# EAGLE schematic 8MIC_ximpedance_J007901D (EAGLE 7.7.0)
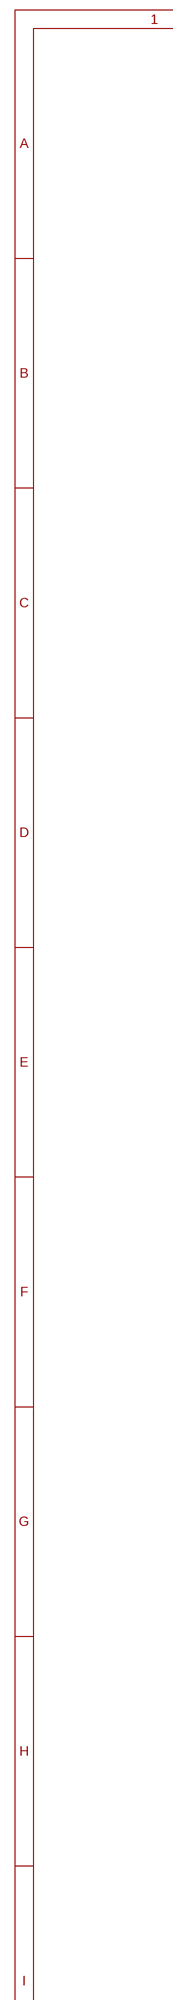
[diagram p0: schematic, sheet 1, part 1 of 2]
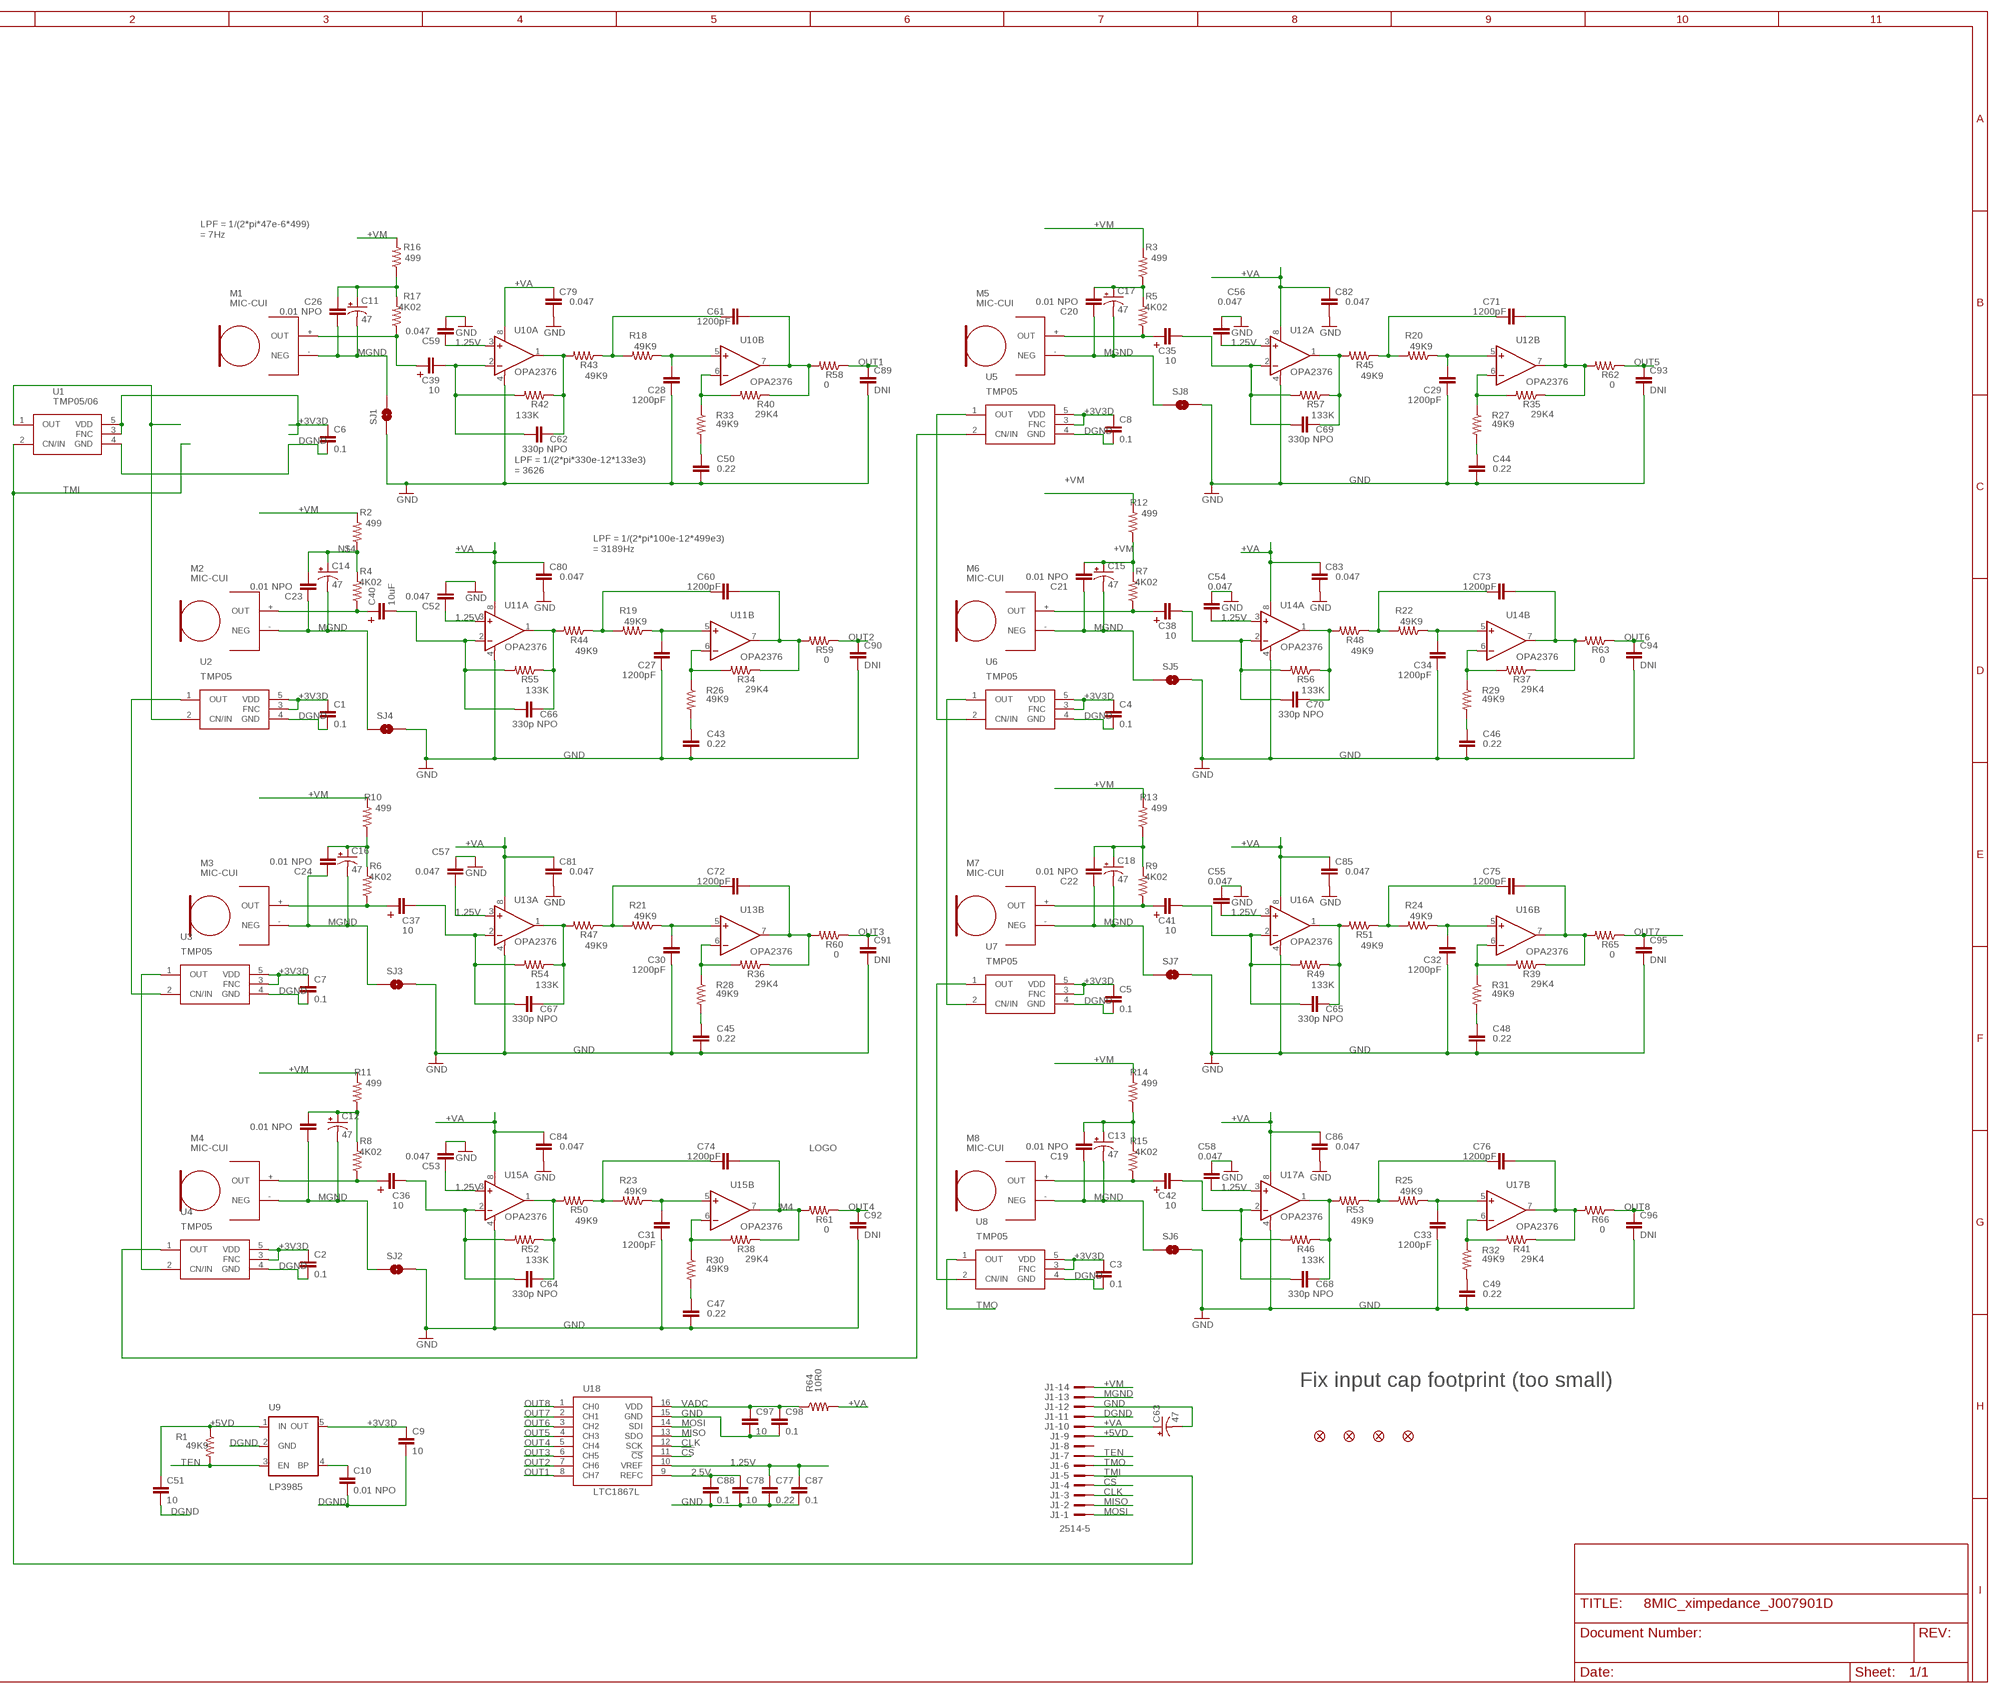
[diagram p1: schematic, sheet 1, part 2 of 2]

## Parts
C1  0.1  CAPS0805S  [0805S]
C2  0.1  CAPS0805S  [0805S]
C3  0.1  CAPS0805S  [0805S]
C4  0.1  CAPS0805S  [0805S]
C5  0.1  CAPS0805S  [0805S]
C6  0.1  CAPS0805S  [0805S]
C7  0.1  CAPS0805S  [0805S]
C8  0.1  CAPS0805S  [0805S]
C9  10  CAPS0805S  [0805S]
C10  0.01 NPO  CAPS0603S  [0603S]
C11  47  CAP_POL1206  [EIA3216]
C12  47  CAP_POL1206  [EIA3216]
C13  47  CAP_POL1206  [EIA3216]
C14  47  CAP_POL1206  [EIA3216]
C15  47  CAP_POL1206  [EIA3216]
C16  47  CAP_POL1206  [EIA3216]
C17  47  CAP_POL1206  [EIA3216]
C18  47  CAP_POL1206  [EIA3216]
C19  0.01 NPO  CAPS0603S  [0603S]
C20  0.01 NPO  CAPS0603S  [0603S]
C21  0.01 NPO  CAPS0603S  [0603S]
C22  0.01 NPO  CAPS0603S  [0603S]
C23  0.01 NPO  CAPS0603S  [0603S]
C24  0.01 NPO  CAPS0603S  [0603S]
C25  0.01 NPO  CAPS0603S  [0603S]
C26  0.01 NPO  CAPS0603S  [0603S]
C27  1200pF  CAPS1206S  [1206S]
C28  1200pF  CAPS1206S  [1206S]
C29  1200pF  CAPS1206S  [1206S]
C30  1200pF  CAPS1206S  [1206S]
C31  1200pF  CAPS1206S  [1206S]
C32  1200pF  CAPS1206S  [1206S]
C33  1200pF  CAPS1206S  [1206S]
C34  1200pF  CAPS1206S  [1206S]
C35  10  CAPS_POLCAP_E_A  [CAP_ELEC_A]
C36  10  CAPS_POLCAP_E_A  [CAP_ELEC_A]
C37  10  CAPS_POLCAP_E_A  [CAP_ELEC_A]
C38  10  CAPS_POLCAP_E_A  [CAP_ELEC_A]
C39  10  CAPS_POLCAP_E_A  [CAP_ELEC_A]
C40  10uF  CAPS_POLCAP_E_A  [CAP_ELEC_A]
C41  10  CAPS_POLCAP_E_A  [CAP_ELEC_A]
C42  10  CAPS_POLCAP_E_A  [CAP_ELEC_A]
C43  0.22  CAPS1206S  [1206S]
C44  0.22  CAPS1206S  [1206S]
C45  0.22  CAPS1206S  [1206S]
C46  0.22  CAPS1206S  [1206S]
C47  0.22  CAPS1206S  [1206S]
C48  0.22  CAPS1206S  [1206S]
C49  0.22  CAPS1206S  [1206S]
C50  0.22  CAPS1206S  [1206S]
C51  10  CAPS0805S  [0805S]
C52  0.047  CAPS0805S  [0805S]
C53  0.047  CAPS0805S  [0805S]
C54  0.047  CAPS0805S  [0805S]
C55  0.047  CAPS0805S  [0805S]
C56  0.047  CAPS0805S  [0805S]
C57  0.047  CAPS0805S  [0805S]
C58  0.047  CAPS0805S  [0805S]
C59  0.047  CAPS0805S  [0805S]
C60  1200pF  CAPS1206S  [1206S]
C61  1200pF  CAPS1206S  [1206S]
C62  330p NPO  CAPS0805S  [0805S]
C63  47  CAP_POL1206  [EIA3216]
C64  330p NPO  CAPS0805S  [0805S]
C65  330p NPO  CAPS0805S  [0805S]
C66  330p NPO  CAPS0805S  [0805S]
C67  330p NPO  CAPS0805S  [0805S]
C68  330p NPO  CAPS0805S  [0805S]
C69  330p NPO  CAPS0805S  [0805S]
C70  330p NPO  CAPS0805S  [0805S]
C71  1200pF  CAPS1206S  [1206S]
C72  1200pF  CAPS1206S  [1206S]
C73  1200pF  CAPS1206S  [1206S]
C74  1200pF  CAPS1206S  [1206S]
C75  1200pF  CAPS1206S  [1206S]
C76  1200pF  CAPS1206S  [1206S]
C77  0.22  CC1206  [C1206]
C78  10  CAPS0805S  [0805S]
C79  0.047  CAPS0805S  [0805S]
C80  0.047  CAPS0805S  [0805S]
C81  0.047  CAPS0805S  [0805S]
C82  0.047  CAPS0805S  [0805S]
C83  0.047  CAPS0805S  [0805S]
C84  0.047  CAPS0805S  [0805S]
C85  0.047  CAPS0805S  [0805S]
C86  0.047  CAPS0805S  [0805S]
C87  0.1  CAPS0805S  [0805S]
C88  0.1  CAPS0805S  [0805S]
C89  DNI  CAPS0603S  [0603S]
C90  DNI  CAPS0603S  [0603S]
C91  DNI  CAPS0603S  [0603S]
C92  DNI  CAPS0603S  [0603S]
C93  DNI  CAPS0603S  [0603S]
C94  DNI  CAPS0603S  [0603S]
C95  DNI  CAPS0603S  [0603S]
C96  DNI  CAPS0603S  [0603S]
C97  10  CAPS0805S  [0805S]
C98  0.1  CAPS0805S  [0805S]
J1  2514-5  [PAK100/2500-5-14]
JP1  FIDUCIAL1.5X3  [FIDUCIAL-1.5X3]
JP2  FIDUCIAL1.5X3  [FIDUCIAL-1.5X3]
JP3  FIDUCIAL1.5X3  [FIDUCIAL-1.5X3]
JP4  FIDUCIAL1.5X3  [FIDUCIAL-1.5X3]
M1  MIC-CUI  [CUI_EDGE]
M2  MIC-CUI  [CUI_EDGE]
M3  MIC-CUI  [CUI_EDGE]
M4  MIC-CUI  [CUI_EDGE]
M5  MIC-CUI  [CUI_EDGE]
M6  MIC-CUI  [CUI_EDGE]
M7  MIC-CUI  [CUI_EDGE]
M8  MIC-CUI  [CUI_EDGE]
R1  49K9  RESISTOR_SM0603S  [0603S]
R2  499  RESISTOR_SM0603S  [0603S]
R3  499  RESISTOR_SM0603S  [0603S]
R4  4K02  RESISTOR_SM0603S  [0603S]
R5  4K02  RESISTOR_SM0603S  [0603S]
R6  4K02  RESISTOR_SM0603S  [0603S]
R7  4K02  RESISTOR_SM0603S  [0603S]
R8  4K02  RESISTOR_SM0603S  [0603S]
R9  4K02  RESISTOR_SM0603S  [0603S]
R10  499  RESISTOR_SM0603S  [0603S]
R11  499  RESISTOR_SM0603S  [0603S]
R12  499  RESISTOR_SM0603S  [0603S]
R13  499  RESISTOR_SM0603S  [0603S]
R14  499  RESISTOR_SM0603S  [0603S]
R15  4K02  RESISTOR_SM0603S  [0603S]
R16  499  RESISTOR_SM0603S  [0603S]
R17  4K02  RESISTOR_SM0603S  [0603S]
R18  49K9  RESISTOR_SM0603S  [0603S]
R19  49K9  RESISTOR_SM0603S  [0603S]
R20  49K9  RESISTOR_SM0603S  [0603S]
R21  49K9  RESISTOR_SM0603S  [0603S]
R22  49K9  RESISTOR_SM0603S  [0603S]
R23  49K9  RESISTOR_SM0603S  [0603S]
R24  49K9  RESISTOR_SM0603S  [0603S]
R25  49K9  RESISTOR_SM0603S  [0603S]
R26  49K9  RESISTOR_SM0603S  [0603S]
R27  49K9  RESISTOR_SM0603S  [0603S]
R28  49K9  RESISTOR_SM0603S  [0603S]
R29  49K9  RESISTOR_SM0603S  [0603S]
R30  49K9  RESISTOR_SM0603S  [0603S]
R31  49K9  RESISTOR_SM0603S  [0603S]
R32  49K9  RESISTOR_SM0603S  [0603S]
R33  49K9  RESISTOR_SM0603S  [0603S]
R34  29K4  RESISTOR_SM0603S  [0603S]
R35  29K4  RESISTOR_SM0603S  [0603S]
R36  29K4  RESISTOR_SM0603S  [0603S]
R37  29K4  RESISTOR_SM0603S  [0603S]
R38  29K4  RESISTOR_SM0603S  [0603S]
R39  29K4  RESISTOR_SM0603S  [0603S]
R40  29K4  RESISTOR_SM0603S  [0603S]
R41  29K4  RESISTOR_SM0603S  [0603S]
R42  133K  RESISTOR_SM0603S  [0603S]
R43  49K9  RESISTOR_SM0603S  [0603S]
R44  49K9  RESISTOR_SM0603S  [0603S]
R45  49K9  RESISTOR_SM0603S  [0603S]
R46  133K  RESISTOR_SM0603S  [0603S]
R47  49K9  RESISTOR_SM0603S  [0603S]
R48  49K9  RESISTOR_SM0603S  [0603S]
R49  133K  RESISTOR_SM0603S  [0603S]
R50  49K9  RESISTOR_SM0603S  [0603S]
R51  49K9  RESISTOR_SM0603S  [0603S]
R52  133K  RESISTOR_SM0603S  [0603S]
R53  49K9  RESISTOR_SM0603S  [0603S]
R54  133K  RESISTOR_SM0603S  [0603S]
R55  133K  RESISTOR_SM0603S  [0603S]
R56  133K  RESISTOR_SM0603S  [0603S]
R57  133K  RESISTOR_SM0603S  [0603S]
R58  0  RESISTOR_SM0603S  [0603S]
R59  0  RESISTOR_SM0603S  [0603S]
R60  0  RESISTOR_SM0603S  [0603S]
R61  0  RESISTOR_SM0603S  [0603S]
R62  0  RESISTOR_SM0603S  [0603S]
R63  0  RESISTOR_SM0603S  [0603S]
R64  10R0  RESISTOR_SM0603S  [0603S]
R65  0  RESISTOR_SM0603S  [0603S]
R66  0  RESISTOR_SM0603S  [0603S]
SJ1  SOLDERJUMPERTRACE  [SJ_2S-TRACE]
SJ2  SOLDERJUMPERTRACE  [SJ_2S-TRACE]
SJ3  SOLDERJUMPERTRACE  [SJ_2S-TRACE]
SJ4  SOLDERJUMPERTRACE  [SJ_2S-TRACE]
SJ5  SOLDERJUMPERTRACE  [SJ_2S-TRACE]
SJ6  SOLDERJUMPERTRACE  [SJ_2S-TRACE]
SJ7  SOLDERJUMPERTRACE  [SJ_2S-TRACE]
SJ8  SOLDERJUMPERTRACE  [SJ_2S-TRACE]
U1  TMP05/06  [SOT-SC-5]
U2  TMP05  TMP05/06  [SOT23-5]
U3  TMP05  TMP05/06  [SOT23-5]
U4  TMP05  TMP05/06  [SOT23-5]
U5  TMP05  TMP05/06  [SOT23-5]
U6  TMP05  TMP05/06  [SOT23-5]
U7  TMP05  TMP05/06  [SOT23-5]
U8  TMP05  TMP05/06  [SOT23-5]
U9  LP3985  MIC5203SMD  [SOT23-5]
U10  OPA2376  OPA2237E  [MSOP08]
U11  OPA2376  OPA2237E  [MSOP08]
U12  OPA2376  OPA2237E  [MSOP08]
U13  OPA2376  OPA2237E  [MSOP08]
U14  OPA2376  OPA2237E  [MSOP08]
U15  OPA2376  OPA2237E  [MSOP08]
U16  OPA2376  OPA2237E  [MSOP08]
U17  OPA2376  OPA2237E  [MSOP08]
U18  LTC1867L  LTC1867  [SSOP16]
U$1  JFRC-LOGOLOGO_OP  [LOGO_BMP_OP]

## Nets
1.25V: C52.2 C53.2 C54.2 C55.2 C56.2 C57.2 C58.2 C59.2 C77.1 C87.1 U10.3(A:+IN) U11.3(A:+IN) U12.3(A:+IN) U13.3(A:+IN) U14.3(A:+IN) U15.3(A:+IN) U16.3(A:+IN) U17.3(A:+IN) U18.10(VREF)
2.5V: C78.1 C88.1 U18.9(REFC)
!CS: J1.4 U18.11(!CS)
+3V3D: C1.1 C2.1 C3.1 C4.1 C5.1 C6.1 C7.1 C8.1 C9.1 U1.3(FNC) U1.5(VDD) U2.3(FNC) U2.5(VDD) U3.3(FNC) U3.5(VDD) U4.3(FNC) U4.5(VDD) U5.3(FNC) U5.5(VDD) U6.3(FNC) U6.5(VDD) U7.3(FNC) U7.5(VDD) U8.3(FNC) U8.5(VDD) U9.5(OUT)
+5VD: C51.1 J1.9 R1.1 U9.1(IN)
+VA: C63.A(+) C79.2 C80.2 C81.2 C82.2 C83.2 C84.2 C85.2 C86.2 J1.10 R64.2 U10.8(A:V+) U11.8(A:V+) U12.8(A:V+) U13.8(A:V+) U14.8(A:V+) U15.8(A:V+) U16.8(A:V+) U17.8(A:V+)
+VM: J1.14 R2.2 R3.2 R10.2 R11.2 R12.2 R13.2 R14.2 R16.2
CLK: J1.3 U18.12(SCK)
DGND: C1.2 C2.2 C3.2 C4.2 C5.2 C6.2 C7.2 C8.2 C9.2 C10.2 C51.2 J1.11 U1.4(GND) U2.4(GND) U3.4(GND) U4.4(GND) U5.4(GND) U6.4(GND) U7.4(GND) U8.4(GND) U9.2(GND)
GND: C27.1 C28.1 C29.1 C30.1 C31.1 C32.1 C33.1 C34.1 C43.1 C44.1 C45.1 C46.1 C47.1 C48.1 C49.1 C50.1 C52.1 C53.1 C54.1 C55.1 C56.1 C57.1 C58.1 C59.1 C63.C(-) C77.2 C78.2 C79.1 C80.1 C81.1 C82.1 C83.1 C84.1 C85.1 C86.1 C87.2 C88.2 C89.2 C90.2 C91.2 C92.2 C93.2 C94.2 C95.2 C96.2 C97.2 C98.2 J1.12 SJ1.1 SJ2.2 SJ3.2 SJ4.2 SJ5.2 SJ6.2 SJ7.2 SJ8.2 U10.4(A:V-) U11.4(A:V-) U12.4(A:V-) U13.4(A:V-) U14.4(A:V-) U15.4(A:V-) U16.4(A:V-) U17.4(A:V-) U18.15(GND)
M1: C61.1 R40.1 R58.2 U10.7(B:OUT)
M2: C60.1 R34.1 R59.2 U11.7(B:OUT)
M3: C72.1 R36.1 R60.2 U13.7(B:OUT)
M4: C74.1 R38.1 R61.2 U15.7(B:OUT)
M5: C71.1 R35.1 R62.2 U12.7(B:OUT)
M6: C73.1 R37.1 R63.2 U14.7(B:OUT)
M7: C75.1 R39.1 R65.2 U16.7(B:OUT)
M8: C76.1 R41.1 R66.2 U17.7(B:OUT)
MGND: C11.C(-) C12.C(-) C13.C(-) C14.C(-) C15.C(-) C16.C(-) C17.C(-) C18.C(-) C19.2 C20.2 C21.2 C22.2 C23.2 C24.2 C25.2 C26.2 J1.13 M1.-(NEG) M2.-(NEG) M3.-(NEG) M4.-(NEG) M5.-(NEG) M6.-(NEG) M7.-(NEG) M8.-(NEG) SJ1.2 SJ2.1 SJ3.1 SJ4.1 SJ5.1 SJ6.1 SJ7.1 SJ8.1
MIC4: C36.P(1P) M4.+(OUT) R8.1
MISO: J1.2 U18.13(SDO)
MOSI: J1.1 U18.14(SDI)
N$1: C39.P(1P) M1.+(OUT) R17.1
N$2: C39.M(2M) C62.2 R42.2 U10.2(A:-IN)
N$3: C40.P(1P) M2.+(OUT) R4.1
N$4: C14.A(+) C23.1 R2.1 R4.2
N$5: C40.M(2M) C66.2 R55.2 U11.2(A:-IN)
N$6: C62.1 R42.1 R43.2 U10.1(A:OUT)
N$7: C11.A(+) C26.1 R16.1 R17.2
N$8: C16.A(+) C24.1 R6.2 R10.1
N$9: C61.2 R18.2 R43.1
N$10: C28.2 R18.1 U10.5(B:+IN)
N$11: C17.A(+) C20.1 R3.1 R5.2
N$12: C50.2 R33.2
N$13: R33.1 R40.2 U10.6(B:-IN)
N$14: C66.1 R44.2 R55.1 U11.1(A:OUT)
N$15: C60.2 R19.2 R44.1
N$16: C27.2 R19.1 U11.5(B:+IN)
N$17: C43.2 R26.2
N$18: R26.1 R34.2 U11.6(B:-IN)
N$19: C37.P(1P) M3.+(OUT) R6.1
N$20: C12.A(+) C25.1 R8.2 R11.1
N$21: C37.M(2M) C67.2 R54.2 U13.2(A:-IN)
N$23: C67.1 R47.2 R54.1 U13.1(A:OUT)
N$24: C72.2 R21.2 R47.1
N$25: C30.2 R21.1 U13.5(B:+IN)
N$26: C45.2 R28.2
N$27: R28.1 R36.2 U13.6(B:-IN)
N$28: C15.A(+) C21.1 R7.2 R12.1
N$29: C18.A(+) C22.1 R9.2 R13.1
N$30: C36.M(2M) C64.2 R52.2 U15.2(A:-IN)
N$31: C13.A(+) C19.1 R14.1 R15.2
N$32: C64.1 R50.2 R52.1 U15.1(A:OUT)
N$33: C74.2 R23.2 R50.1
N$34: C31.2 R23.1 U15.5(B:+IN)
N$35: C47.2 R30.2
N$36: R30.1 R38.2 U15.6(B:-IN)
N$39: C35.M(2M) C69.2 R57.2 U12.2(A:-IN)
N$41: C69.1 R45.2 R57.1 U12.1(A:OUT)
N$42: C71.2 R20.2 R45.1
N$43: C29.2 R20.1 U12.5(B:+IN)
N$44: C44.2 R27.2
N$45: R27.1 R35.2 U12.6(B:-IN)
N$46: C38.P(1P) M6.+(OUT) R7.1
N$48: C38.M(2M) C70.2 R56.2 U14.2(A:-IN)
N$50: C70.1 R48.2 R56.1 U14.1(A:OUT)
N$51: C73.2 R22.2 R48.1
N$52: C34.2 R22.1 U14.5(B:+IN)
N$53: C46.2 R29.2
N$54: R29.1 R37.2 U14.6(B:-IN)
N$55: C41.P(1P) M7.+(OUT) R9.1
N$57: C41.M(2M) C65.2 R49.2 U16.2(A:-IN)
N$59: C65.1 R49.1 R51.2 U16.1(A:OUT)
N$60: C75.2 R24.2 R51.1
N$61: C32.2 R24.1 U16.5(B:+IN)
N$62: C48.2 R31.2
N$63: R31.1 R39.2 U16.6(B:-IN)
N$64: C42.P(1P) M8.+(OUT) R15.1
N$66: C42.M(2M) C68.2 R46.2 U17.2(A:-IN)
N$68: C68.1 R46.1 R53.2 U17.1(A:OUT)
N$69: C76.2 R25.2 R53.1
N$70: C33.2 R25.1 U17.5(B:+IN)
N$71: C49.2 R32.2
N$72: R32.1 R41.2 U17.6(B:-IN)
N$75: U1.1(OUT) U2.2(CN/IN)
N$76: U2.1(OUT) U3.2(CN/IN)
N$77: U3.1(OUT) U4.2(CN/IN)
N$78: U4.1(OUT) U5.2(CN/IN)
N$79: U5.1(OUT) U6.2(CN/IN)
N$80: U6.1(OUT) U7.2(CN/IN)
N$81: U7.1(OUT) U8.2(CN/IN)
N$84: C10.1 U9.4(BP)
N$90: C35.P(1P) M5.+(OUT) R5.1
OUT1: C89.1 R58.1 U18.8(CH7)
OUT2: C90.1 R59.1 U18.7(CH6)
OUT3: C91.1 R60.1 U18.6(CH5)
OUT4: C92.1 R61.1 U18.5(CH4)
OUT5: C93.1 R62.1 U18.4(CH3)
OUT6: C94.1 R63.1 U18.3(CH2)
OUT7: C95.1 R65.1 U18.2(CH1)
OUT8: C96.1 R66.1 U18.1(CH0)
TEN: J1.7 R1.2 U9.3(EN)
TMI: J1.5 U1.2(CN/IN)
TMO: J1.6 U8.1(OUT)
VADC: C97.1 C98.1 R64.1 U18.16(VDD)
Unconnected: J1.8

## Notes on the sheet
- LPF = 1/(2*pi*47e-6*499) 
  = 7Hz
- LPF = 1/(2*pi*330e-12*133e3)
  = 3626
- LPF = 1/(2*pi*100e-12*499e3)
  = 3189Hz
- Fix input cap footprint (too small)

## Library data of the parts
C1-C10 C19-C34 C43-C62 C64-C76 C78-C98 = STEVES_BU:CAPS
C11-C18 C63 = SparkFun:CAP_POL: Capacitor Polarized These are standard SMD and PTH capacitors. Normally 10uF, 47uF, and 100uF in electrolytic and tantalum varieties. Always verify the external diameter of the through hole cap, it varies with capacity, voltage, and manufacturer. The EIA devices should be standard.
C35-C42 = STEVES_BU:CAPS_POL
C77 = eagle-ltspice:C: CAPACITOR, European symbol; SPICEMODEL: NONE; SPICEPREFIX: C
J1 = con-3m:2514-: 3M (TM) Pak 100 4-Wall Header Source: 3M; MPN: N2514-5002RB; OC_FARNELL: 1788673; OC_NEWARK: 97K6709
JP1-JP4 = SparkFun:FIDUCIAL: Fiducial Alignment Points Various fiducial points for machine vision alignment.
M1-M8 = STEVES_BU:MIC-CUI
R1-R66 = STEVES_BU:RESISTOR_SM
SJ1-SJ8 = SparkFun:SOLDERJUMPER: Solder Jumper Standard SMD solder jumper. Used to automate production. Two varients : Normally Open and Normally Closed are the same, but have different paste layers. NC will have a large amount of paste and should jumper during reflow.
U1 = STEVES_BU:TMP05/06
U2-U8 = analog-devices_sws:TMP05/06
U9 = jfrc:MIC5203: Voltage Regulator LDO Standard 150mA LDO voltage regulator in SOT-23 layout. Micrel part MIC5205. BP (by-pass) pin is used to lower output noise with 470pF cap.
U10-U17 = burr-brown:OPA2237: Single-Supply Operational Amplifiers MicroAmplifier(TM) Series; Product Folder:OPA2237; MF: TEXAS INSTRUMENTS; MPN: OPA2237EA/250; OC_FARNELL: 1470365; OC_NEWARK: 35C1853
U18 = linear-technology:LTC1867
U$1 = STEVES_BU:JFRC-LOGO